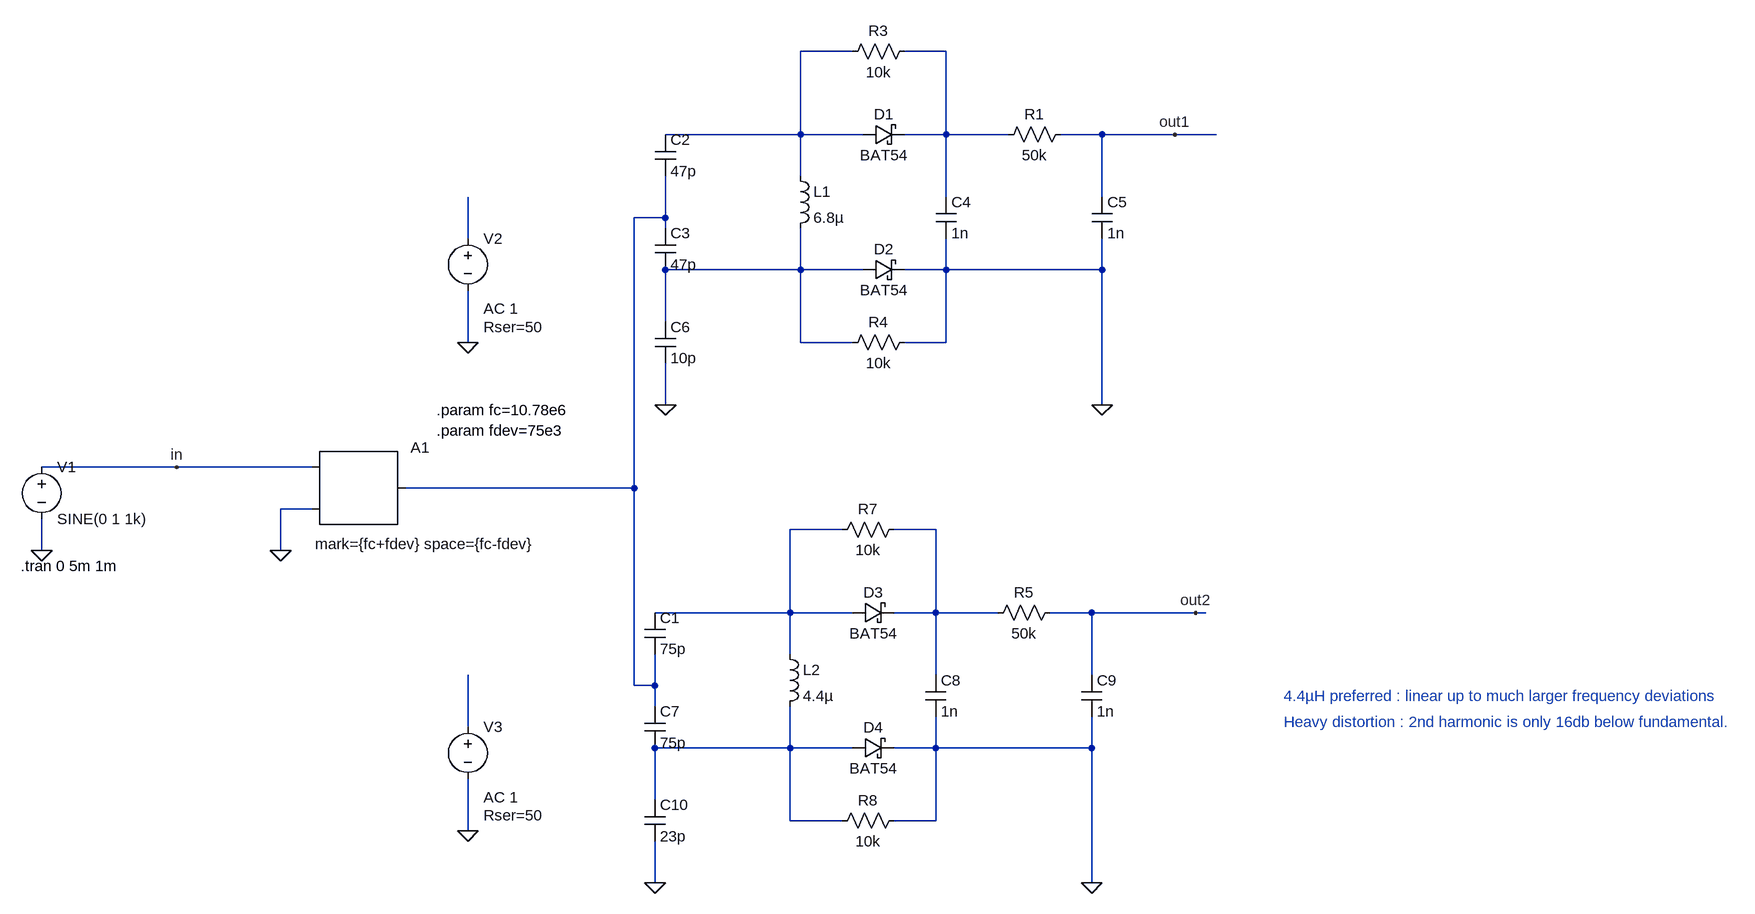
[diagram p0: schematic Weiss_discriminator.asc]
Weiss_discriminator.asc, the LTspice schematic file:
Version 4
SHEET 1 2368 1076
WIRE 944 -224 864 -224
WIRE 1088 -224 1024 -224
WIRE 864 -96 864 -224
WIRE 864 -96 656 -96
WIRE 960 -96 864 -96
WIRE 1088 -96 1088 -224
WIRE 1088 -96 1024 -96
WIRE 1184 -96 1088 -96
WIRE 1328 -96 1264 -96
WIRE 1440 -96 1328 -96
WIRE 1504 -96 1440 -96
WIRE 864 -32 864 -96
WIRE 1088 0 1088 -96
WIRE 1328 0 1328 -96
WIRE 656 32 656 -32
WIRE 656 32 608 32
WIRE 656 48 656 32
WIRE 352 64 352 0
WIRE 864 112 864 48
WIRE 864 112 656 112
WIRE 960 112 864 112
WIRE 1088 112 1088 64
WIRE 1088 112 1024 112
WIRE 1328 112 1328 64
WIRE 1328 112 1088 112
WIRE 656 192 656 112
WIRE 352 224 352 144
WIRE 864 224 864 112
WIRE 944 224 864 224
WIRE 1088 224 1088 112
WIRE 1088 224 1024 224
WIRE 656 320 656 256
WIRE 1328 320 1328 112
WIRE -96 416 -304 416
WIRE 112 416 -96 416
WIRE 608 448 608 32
WIRE 608 448 256 448
WIRE 112 480 64 480
WIRE 928 512 848 512
WIRE 1072 512 1008 512
WIRE -304 544 -304 496
WIRE 64 544 64 480
WIRE 848 640 848 512
WIRE 848 640 640 640
WIRE 944 640 848 640
WIRE 1072 640 1072 512
WIRE 1072 640 1008 640
WIRE 1168 640 1072 640
WIRE 1312 640 1248 640
WIRE 1472 640 1312 640
WIRE 1488 640 1472 640
WIRE 848 704 848 640
WIRE 1072 736 1072 640
WIRE 1312 736 1312 640
WIRE 608 752 608 448
WIRE 640 752 640 704
WIRE 640 752 608 752
WIRE 640 784 640 752
WIRE 352 816 352 736
WIRE 848 848 848 784
WIRE 848 848 640 848
WIRE 944 848 848 848
WIRE 1072 848 1072 800
WIRE 1072 848 1008 848
WIRE 1312 848 1312 800
WIRE 1312 848 1072 848
WIRE 640 928 640 848
WIRE 848 960 848 848
WIRE 928 960 848 960
WIRE 1072 960 1072 848
WIRE 1072 960 1008 960
WIRE 352 976 352 896
WIRE 640 1056 640 992
WIRE 1312 1056 1312 848
FLAG 64 544 0
FLAG -304 544 0
FLAG 656 320 0
FLAG 1328 320 0
FLAG 1440 -96 out1
FLAG 352 224 0
FLAG 640 1056 0
FLAG 1312 1056 0
FLAG 1472 640 out2
FLAG 352 976 0
FLAG -96 416 in
SYMBOL SpecialFunctions\\modulate 112 416 R0
WINDOW 3 5 118 Left 2
SYMATTR Value mark={fc+fdev} space={fc-fdev}
SYMATTR InstName A1
SYMBOL voltage -304 400 R0
WINDOW 123 0 0 Left 0
WINDOW 39 0 0 Left 0
SYMATTR InstName V1
SYMATTR Value SINE(0 1 1k)
SYMBOL ind 848 -48 R0
SYMATTR InstName L1
SYMATTR Value 6.8µ
SYMBOL cap 640 -96 R0
SYMATTR InstName C2
SYMATTR Value 47p
SYMBOL cap 640 48 R0
SYMATTR InstName C3
SYMATTR Value 47p
SYMBOL schottky 960 -80 R270
WINDOW 0 32 32 VTop 2
WINDOW 3 0 32 VBottom 2
SYMATTR InstName D1
SYMATTR Value BAT54
SYMATTR Description Diode
SYMATTR Type diode
SYMBOL schottky 960 128 R270
WINDOW 0 32 32 VTop 2
WINDOW 3 0 32 VBottom 2
SYMATTR InstName D2
SYMATTR Value BAT54
SYMATTR Description Diode
SYMATTR Type diode
SYMBOL cap 1072 0 R0
SYMATTR InstName C4
SYMATTR Value 1n
SYMBOL res 1280 -112 R90
WINDOW 0 0 56 VBottom 2
WINDOW 3 32 56 VTop 2
SYMATTR InstName R1
SYMATTR Value 50k
SYMBOL cap 1312 0 R0
SYMATTR InstName C5
SYMATTR Value 1n
SYMBOL cap 640 192 R0
SYMATTR InstName C6
SYMATTR Value 10p
SYMBOL res 1040 -240 R90
WINDOW 0 0 56 VBottom 2
WINDOW 3 32 56 VTop 2
SYMATTR InstName R3
SYMATTR Value 10k
SYMBOL res 1040 208 R90
WINDOW 0 0 56 VBottom 2
WINDOW 3 32 56 VTop 2
SYMATTR InstName R4
SYMATTR Value 10k
SYMBOL voltage 352 48 R0
WINDOW 123 24 124 Left 2
WINDOW 39 24 152 Left 2
SYMATTR InstName V2
SYMATTR Value ""
SYMATTR Value2 AC 1
SYMATTR SpiceLine Rser=50
SYMBOL ind 832 688 R0
SYMATTR InstName L2
SYMATTR Value 4.4µ
SYMBOL cap 624 640 R0
SYMATTR InstName C1
SYMATTR Value 75p
SYMBOL cap 624 784 R0
SYMATTR InstName C7
SYMATTR Value 75p
SYMBOL schottky 944 656 R270
WINDOW 0 32 32 VTop 2
WINDOW 3 0 32 VBottom 2
SYMATTR InstName D3
SYMATTR Value BAT54
SYMATTR Description Diode
SYMATTR Type diode
SYMBOL schottky 944 864 R270
WINDOW 0 32 32 VTop 2
WINDOW 3 0 32 VBottom 2
SYMATTR InstName D4
SYMATTR Value BAT54
SYMATTR Description Diode
SYMATTR Type diode
SYMBOL cap 1056 736 R0
SYMATTR InstName C8
SYMATTR Value 1n
SYMBOL res 1264 624 R90
WINDOW 0 0 56 VBottom 2
WINDOW 3 32 56 VTop 2
SYMATTR InstName R5
SYMATTR Value 50k
SYMBOL cap 1296 736 R0
SYMATTR InstName C9
SYMATTR Value 1n
SYMBOL cap 624 928 R0
SYMATTR InstName C10
SYMATTR Value 23p
SYMBOL res 1024 496 R90
WINDOW 0 0 56 VBottom 2
WINDOW 3 32 56 VTop 2
SYMATTR InstName R7
SYMATTR Value 10k
SYMBOL res 1024 944 R90
WINDOW 0 0 56 VBottom 2
WINDOW 3 32 56 VTop 2
SYMATTR InstName R8
SYMATTR Value 10k
SYMBOL voltage 352 800 R0
WINDOW 123 24 124 Left 2
WINDOW 39 24 152 Left 2
SYMATTR InstName V3
SYMATTR Value ""
SYMATTR Value2 AC 1
SYMATTR SpiceLine Rser=50
TEXT -336 568 Left 2 !.tran 0 5m 1m
TEXT 304 328 Left 2 !.param fc=10.78e6\n.param fdev=75e3
TEXT 1608 768 Left 2 ;4.4µH preferred : linear up to much larger frequency deviations
TEXT 1608 808 Left 2 ;Heavy distortion : 2nd harmonic is only 16db below fundamental.

The netlist it stands for:
* Weiss_discriminator.asc
A1 in 0 0 0 0 0 N003 0 MODULATOR mark={fc+fdev} space={fc-fdev}
V1 in 0 SINE(0 1 1k)
L1 N001 N005 6.8µ
C2 N001 N003 47p
C3 N003 N005 47p
D1 N001 N002 BAT54
D2 N005 0 BAT54
C4 N002 0 1n
R1 out1 N002 50k
C5 out1 0 1n
C6 N005 0 10p
R3 N002 N001 10k
R4 0 N005 10k
V2 N004 0 AC 1 Rser=50
L2 N006 N009 4.4µ
C1 N006 N003 75p
C7 N003 N009 75p
D3 N006 N007 BAT54
D4 N009 0 BAT54
C8 N007 0 1n
R5 out2 N007 50k
C9 out2 0 1n
C10 N009 0 23p
R7 N007 N006 10k
R8 0 N009 10k
V3 N008 0 AC 1 Rser=50
.model D D
.lib standard.dio
.tran 0 5m 1m
.param fc=10.78e6
.param fdev=75e3
* 4.4µH preferred : linear up to much larger frequency deviations
* Heavy distortion : 2nd harmonic is only 16db below fundamental.
.backanno
.end